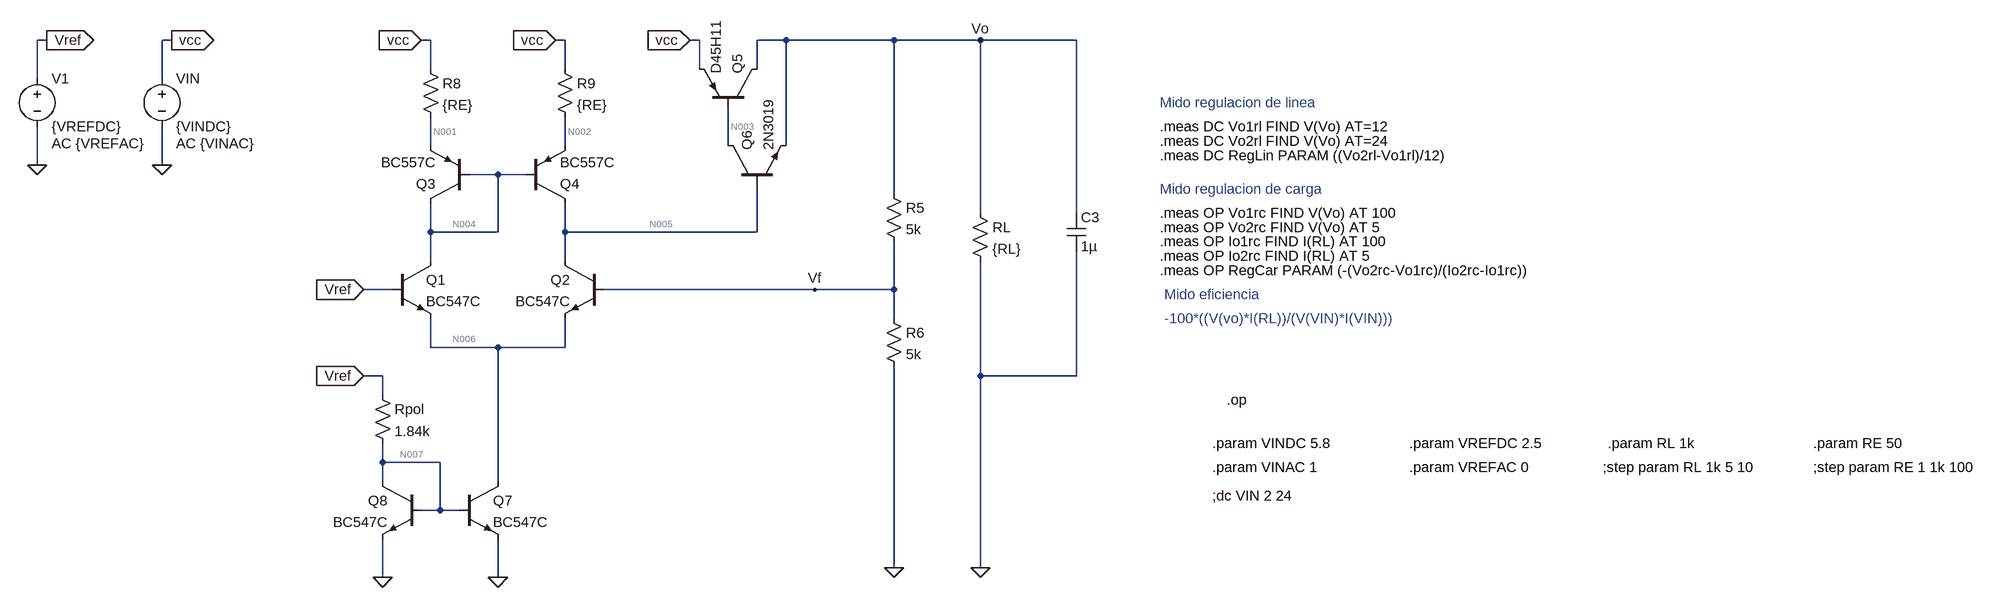
[diagram p0: schematic Version 2.asc]
Version 2.asc, the LTspice schematic file:
Version 4
SHEET 1 3148 1188
WIRE -544 -128 -560 -128
WIRE -336 -128 -352 -128
WIRE 96 -128 80 -128
WIRE 320 -128 304 -128
WIRE 544 -128 528 -128
WIRE 688 -128 640 -128
WIRE 880 -128 688 -128
WIRE 1024 -128 880 -128
WIRE 1184 -128 1024 -128
WIRE 96 -80 96 -128
WIRE 320 -80 320 -128
WIRE 544 -80 544 -128
WIRE 640 -80 640 -128
WIRE -560 -64 -560 -128
WIRE -352 -64 -352 -128
WIRE 96 48 96 0
WIRE 320 48 320 0
WIRE 592 48 592 -16
WIRE 688 48 688 -128
WIRE -560 80 -560 16
WIRE -352 80 -352 16
WIRE 208 96 160 96
WIRE 256 96 208 96
WIRE 880 128 880 -128
WIRE 1024 160 1024 -128
WIRE 1184 160 1184 -128
WIRE 96 192 96 144
WIRE 208 192 208 96
WIRE 208 192 96 192
WIRE 320 192 320 144
WIRE 640 192 640 112
WIRE 640 192 320 192
WIRE 96 240 96 192
WIRE 320 240 320 192
WIRE 32 288 -16 288
WIRE 736 288 384 288
WIRE 880 288 880 208
WIRE 880 288 736 288
WIRE 880 336 880 288
WIRE 96 384 96 336
WIRE 208 384 96 384
WIRE 320 384 320 336
WIRE 320 384 208 384
WIRE 16 432 -16 432
WIRE 1024 432 1024 240
WIRE 1184 432 1184 224
WIRE 1184 432 1024 432
WIRE 16 464 16 432
WIRE 16 576 16 544
WIRE 112 576 16 576
WIRE 16 608 16 576
WIRE 208 608 208 384
WIRE 112 656 112 576
WIRE 112 656 80 656
WIRE 144 656 112 656
WIRE 880 752 880 416
WIRE 1024 752 1024 432
WIRE 16 768 16 704
WIRE 208 768 208 704
FLAG 1024 -128 Vo
FLAG -544 -128 Vref
IOPIN -544 -128 Out
FLAG 736 288 Vf
FLAG -560 80 0
FLAG -336 -128 vcc
IOPIN -336 -128 Out
FLAG 1024 752 0
FLAG 880 752 0
FLAG -16 288 Vref
IOPIN -16 288 In
FLAG -16 432 Vref
IOPIN -16 432 In
FLAG -352 80 0
FLAG 16 768 0
FLAG 208 768 0
FLAG 80 -128 vcc
IOPIN 80 -128 In
FLAG 304 -128 vcc
IOPIN 304 -128 In
FLAG 528 -128 vcc
IOPIN 528 -128 In
DATAFLAG 848 -32 ""
DATAFLAG 528 -128 ""
DATAFLAG 736 -128 ""
DATAFLAG 592 0 ""
DATAFLAG 640 144 ""
DATAFLAG 320 0 ""
DATAFLAG 96 32 ""
DATAFLAG 176 96 ""
DATAFLAG 96 192 ""
DATAFLAG 320 -128 ""
SYMBOL pnp 160 144 R180
SYMATTR InstName Q3
SYMATTR Value BC557C
SYMBOL pnp 256 144 M180
SYMATTR InstName Q4
SYMATTR Value BC557C
SYMBOL npn 32 240 R0
SYMATTR InstName Q1
SYMATTR Value BC547C
SYMBOL npn 384 240 M0
SYMATTR InstName Q2
SYMATTR Value BC547C
SYMBOL pnp 640 -16 M270
SYMATTR InstName Q5
SYMATTR Value D45H11
SYMBOL npn 592 112 R270
SYMATTR InstName Q6
SYMATTR Value 2N3019
SYMBOL res 864 112 R0
SYMATTR InstName R5
SYMATTR Value 5k
SYMBOL res 864 320 R0
SYMATTR InstName R6
SYMATTR Value 5k
SYMBOL res 1008 144 R0
SYMATTR InstName RL
SYMATTR Value {RL}
SYMBOL voltage -560 -80 R0
WINDOW 123 24 124 Left 2
WINDOW 39 0 0 Left 0
SYMATTR Value2 AC {VREFAC}
SYMATTR InstName V1
SYMATTR Value {VREFDC}
SYMBOL res 80 -96 R0
SYMATTR InstName R8
SYMATTR Value {RE}
SYMBOL res 304 -96 R0
SYMATTR InstName R9
SYMATTR Value {RE}
SYMBOL cap 1168 160 R0
SYMATTR InstName C3
SYMATTR Value 1µ
SYMBOL voltage -352 -80 R0
WINDOW 123 24 124 Left 2
WINDOW 39 0 0 Left 0
SYMATTR InstName VIN
SYMATTR Value {VINDC}
SYMATTR Value2 AC {VINAC}
SYMBOL npn 144 608 R0
SYMATTR InstName Q7
SYMATTR Value BC547C
SYMBOL npn 80 608 M0
SYMATTR InstName Q8
SYMATTR Value BC547C
SYMBOL res 0 448 R0
SYMATTR InstName Rpol
SYMATTR Value 1.84k
TEXT 1760 472 Left 2 !.op
TEXT 1736 544 Left 2 !.param VINDC 5.8
TEXT 1736 584 Left 2 !.param VINAC 1
TEXT 2064 544 Left 2 !.param VREFDC 2.5
TEXT 2064 584 Left 2 !.param VREFAC 0
TEXT 2408 544 Left 2 !.param RL 1k
TEXT 1736 632 Left 2 !;dc VIN 2 24
TEXT 2816 584 Left 2 !;step param RE 1 1k 100
TEXT 2816 544 Left 2 !.param RE 50
TEXT 2400 584 Left 2 !;step param RL 1k 5 10
TEXT 1648 -24 Left 2 ;Mido regulacion de linea
TEXT 1648 16 Left 2 !.meas DC Vo1rl FIND V(Vo) AT=12
TEXT 1648 40 Left 2 !.meas DC Vo2rl FIND V(Vo) AT=24
TEXT 1648 64 Left 2 !.meas DC RegLin PARAM ((Vo2rl-Vo1rl)/12)
TEXT 1648 120 Left 2 ;Mido regulacion de carga
TEXT 1648 160 Left 2 !.meas OP Vo1rc FIND V(Vo) AT 100
TEXT 1648 184 Left 2 !.meas OP Vo2rc FIND V(Vo) AT 5
TEXT 1648 208 Left 2 !.meas OP Io1rc FIND I(RL) AT 100
TEXT 1648 232 Left 2 !.meas OP Io2rc FIND I(RL) AT 5
TEXT 1656 296 Left 2 ;Mido eficiencia
TEXT 1656 336 Left 2 ;-100*((V(vo)*I(RL))/(V(VIN)*I(VIN)))
TEXT 1648 256 Left 2 !.meas OP RegCar PARAM (-(Vo2rc-Vo1rc)/(Io2rc-Io1rc))

The netlist it stands for:
* Version 2.asc
Q3 N004 N004 N001 0 BC557C
Q4 N005 N004 N002 0 BC557C
Q1 N004 Vref N006 0 BC547C
Q2 N005 Vf N006 0 BC547C
Q5 Vo N003 vcc 0 D45H11
Q6 N003 N005 Vo 0 2N3019
R5 Vo Vf 5k
R6 Vf 0 5k
RL Vo 0 {RL}
V1 Vref 0 {VREFDC} AC {VREFAC}
R8 vcc N001 {RE}
R9 vcc N002 {RE}
C3 Vo 0 1µ
VIN vcc 0 {VINDC} AC {VINAC}
Q7 N006 N007 0 0 BC547C
Q8 N007 N007 0 0 BC547C
Rpol Vref N007 1.84k
.model NPN NPN
.model PNP PNP
.lib standard.bjt
.op
.param VINDC 5.8
.param VINAC 1
.param VREFDC 2.5
.param VREFAC 0
.param RL 1k
;dc VIN 2 24
;step param RE 1 1k 100
.param RE 50
;step param RL 1k 5 10
* Mido regulacion de linea
.meas DC Vo1rl FIND V(Vo) AT=12
.meas DC Vo2rl FIND V(Vo) AT=24
.meas DC RegLin PARAM ((Vo2rl-Vo1rl)/12)
* Mido regulacion de carga
.meas OP Vo1rc FIND V(Vo) AT 100
.meas OP Vo2rc FIND V(Vo) AT 5
.meas OP Io1rc FIND I(RL) AT 100
.meas OP Io2rc FIND I(RL) AT 5
* Mido eficiencia
* -100*((V(vo)*I(RL))/(V(VIN)*I(VIN)))
.meas OP RegCar PARAM (-(Vo2rc-Vo1rc)/(Io2rc-Io1rc))
.backanno
.end

* Results of the author's LTspice run, read from the files saved beside the schematic
* Operating Point:
*   V(n004) = 5.173 V
*   V(n001) = 5.774 V
*   V(n005) = 5.586 V
*   V(n002) = 5.774 V
*   V(vref) = 2.5 V
*   V(n006) = 1.897 V
*   V(vf) = 2.499 V
*   V(vo) = 5.004 V
*   V(n003) = 5.403 V
*   V(vcc) = 5.8 V
*   V(n007) = 622.3 mV
*   Ic(Q6) = 80.63 µA
*   Ib(Q6) = 403.9 nA
*   Ie(Q6) = -82.58 µA
*   Ic(Q5) = -5.424 mA
*   Ib(Q5) = -80.63 µA
*   Ie(Q5) = 5.505 mA
*   Ic(Q8) = 1.016 mA
*   Ib(Q8) = 2.246 µA
*   Ie(Q8) = -1.018 mA
*   Ic(Q7) = 1.04 mA
*   Ib(Q7) = 2.245 µA
*   Ie(Q7) = -1.043 mA
*   Ic(Q2) = 515.3 µA
*   Ib(Q2) = 1.073 µA
*   Ie(Q2) = -516.4 µA
*   Ic(Q1) = 522.9 µA
*   Ib(Q1) = 1.097 µA
*   Ie(Q1) = -524 µA
*   Ic(Q4) = -515.7 µA
*   Ib(Q4) = -1.225 µA
*   Ie(Q4) = 516.9 µA
*   Ic(Q3) = -520.5 µA
*   Ib(Q3) = -1.171 µA
*   Ie(Q3) = 521.7 µA
*   I(C3) = 0 A
*   I(Rpol) = 1.021 mA
*   I(R9) = 516.9 µA
*   I(R8) = 521.7 µA
*   I(Rl) = 5.004 mA
*   I(R6) = 499.9 µA
*   I(R5) = 501 µA
*   I(Vin) = -6.543 mA
*   I(V1) = -1.022 mA
* From the log:
*   Semiconductor Device Operating Points:
*                           --- Bipolar Transistors ---
*   Name:       q6          q5          q8          q7          q2
*   Model:    2n3019      d45h11      bc547c      bc547c      bc547c
*   Ib:       4.04e-07   -8.06e-05    2.25e-06    2.25e-06    1.07e-06
*   Ic:       8.06e-05   -5.42e-03    1.02e-03    1.04e-03    5.15e-04
*   Vbe:      5.82e-01   -3.97e-01    6.22e-01    6.22e-01    6.03e-01
*   Vbc:      1.83e-01    3.99e-01    0.00e+00   -1.27e+00   -3.09e+00
*   Vce:      3.99e-01   -7.96e-01    6.22e-01    1.90e+00    3.69e+00
*   BetaDC:   2.00e+02    6.73e+01    4.52e+02    4.63e+02    4.80e+02
*   Gm:       3.18e-03    2.46e-01    3.86e-02    3.95e-02    1.96e-02
*   Rpi:      6.28e+04    2.73e+02    1.17e+04    1.17e+04    2.44e+04
*   Rx:       1.00e+01    2.35e+00    1.00e+00    1.00e+00    1.00e+00
*   Ro:       1.21e+06    2.01e+03    5.17e+04    5.17e+04    1.08e+05
*   Cbe:      6.90e-11    2.39e-09    5.00e-11    5.05e-11    4.00e-11
*   Cbc:      1.77e-11    3.42e-10    2.74e-12    1.57e-12    1.26e-12
*   Cjs:      0.00e+00    0.00e+00    0.00e+00    0.00e+00    0.00e+00
*   BetaAC:   2.00e+02    6.70e+01    4.50e+02    4.60e+02    4.79e+02
*   Cbx:      0.00e+00    8.39e-11    1.69e-12    9.65e-13    7.72e-13
*   Ft:       5.83e+06    1.39e+07    1.13e+08    1.19e+08    7.45e+07
*   Name:       q1          q4          q3
*   Model:    bc547c      bc557c      bc557c
*   Ib:       1.10e-06   -1.23e-06   -1.17e-06
*   Ic:       5.23e-04   -5.16e-04   -5.21e-04
*   Vbe:      6.03e-01   -6.01e-01   -6.01e-01
*   Vbc:     -2.67e+00   -4.13e-01    0.00e+00
*   Vce:      3.28e+00   -1.88e-01   -6.01e-01
*   BetaDC:   4.77e+02    4.21e+02    4.45e+02
*   Gm:       1.99e-02    1.95e-02    1.97e-02
*   Rpi:      2.39e+04    2.24e+04    2.26e+04
*   Rx:       1.00e+00    1.00e+00    1.00e+00
*   Ro:       1.06e+05    2.63e+04    4.55e+04
*   Cbe:      4.01e-11    4.15e-11    4.15e-11
*   Cbc:      1.30e-12    8.23e-12    4.91e-12
*   Cjs:      0.00e+00    0.00e+00    0.00e+00
*   BetaAC:   4.76e+02    4.37e+02    4.45e+02
*   Cbx:      8.01e-13    4.86e-12    2.90e-12
*   Ft:       7.51e+07    5.69e+07    6.35e+07
*   vo1rc: v(vo)=96.7365 at 100
*   vo2rc: v(vo)=4.83682 at 5
*   io1rc: i(rl)=0.0967365 at 100
*   io2rc: i(rl)=0.00483682 at 5
*   regcar: (-(vo2rc-vo1rc)/(io2rc-io1rc))=-1000